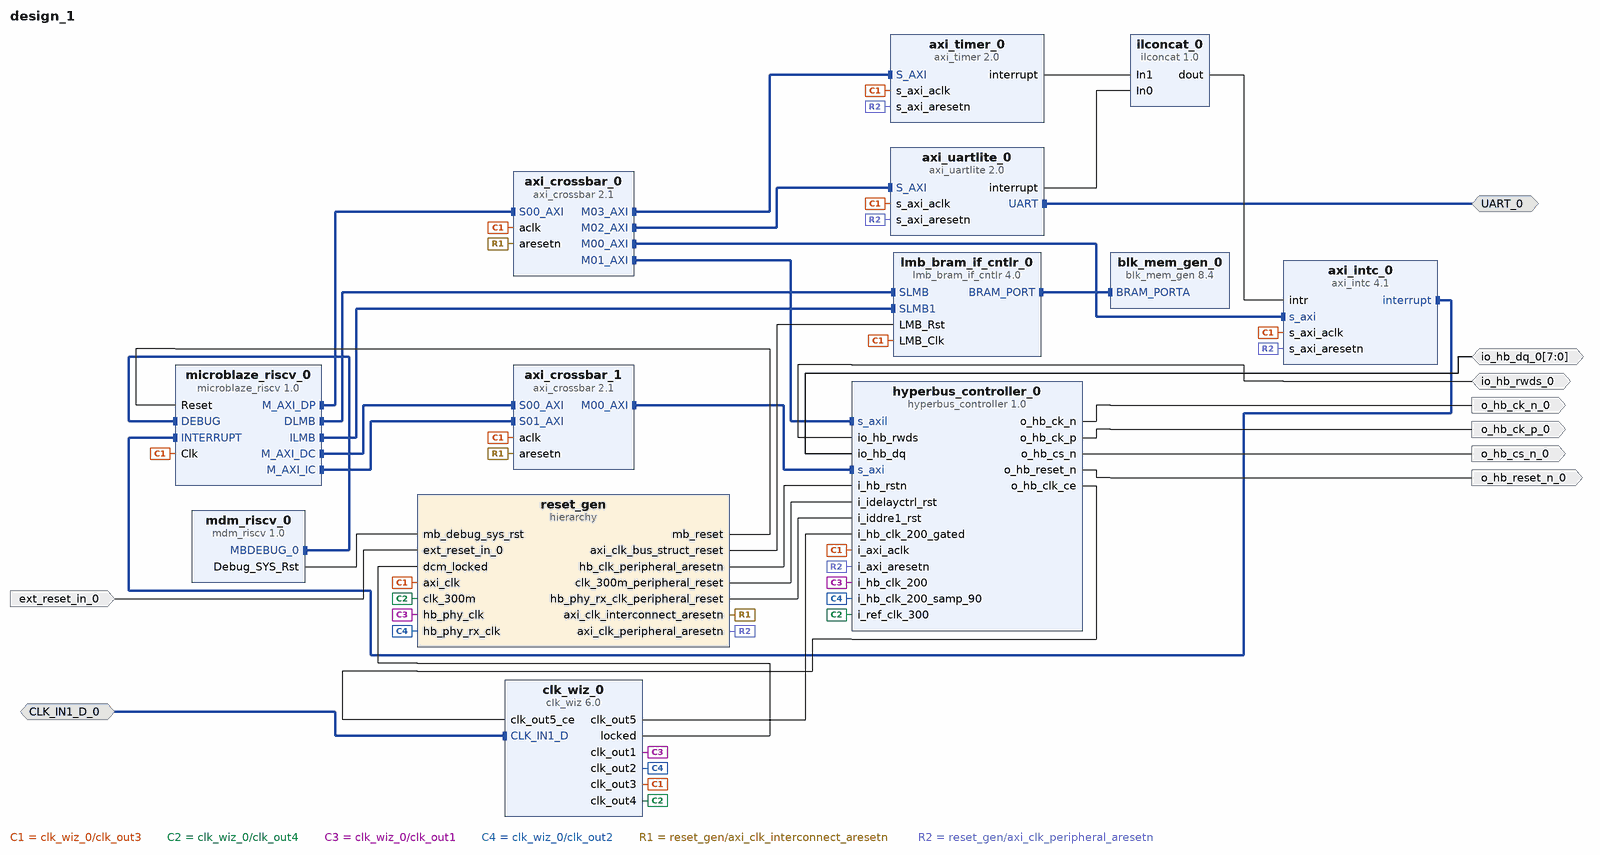
[diagram p0: block diagram of the top level]
# Vivado block design design_1, xcsu35p-sbvb625-2-e, Vivado 2025.2
create_bd_design design_1

create_bd_intf_port -mode Slave -vlnv xilinx.com:interface:diff_clock_rtl:1.0 CLK_IN1_D_0
create_bd_intf_port -mode Master -vlnv xilinx.com:interface:uart_rtl:1.0 UART_0
create_bd_port -dir O o_hb_cs_n_0
create_bd_port -dir O o_hb_ck_p_0
create_bd_port -dir O o_hb_ck_n_0
create_bd_port -dir IO io_hb_rwds_0
create_bd_port -dir IO -from 7 -to 0 io_hb_dq_0
create_bd_port -dir O o_hb_reset_n_0
create_bd_port -dir I -type rst ext_reset_in_0

create_bd_cell -type ip -vlnv xilinx.com:ip:microblaze_riscv:1.0 microblaze_riscv_0
set_property -dict [list \
  CONFIG.C_D_AXI 1 \
  CONFIG.C_I_AXI 0 \
  CONFIG.C_I_LMB 1 \
  CONFIG.C_USE_BITMAN_A 0 \
  CONFIG.C_USE_DCACHE 1 \
  CONFIG.C_USE_ICACHE 1 \
  CONFIG.G_TEMPLATE_LIST 1 \
] [get_bd_cells microblaze_riscv_0]
create_bd_cell -type ip -vlnv xilinx.com:ip:mdm_riscv:1.0 mdm_riscv_0
create_bd_cell -type ip -vlnv xilinx.com:ip:clk_wiz:6.0 clk_wiz_0
set_property -dict [list \
  CONFIG.AXI_DRP false \
  CONFIG.CLKOUT1_JITTER 102.086 \
  CONFIG.CLKOUT1_MATCHED_ROUTING true \
  CONFIG.CLKOUT1_REQUESTED_OUT_FREQ 200 \
  CONFIG.CLKOUT2_JITTER 102.086 \
  CONFIG.CLKOUT2_MATCHED_ROUTING true \
  CONFIG.CLKOUT2_PHASE_ERROR 87.180 \
  CONFIG.CLKOUT2_REQUESTED_OUT_FREQ 200 \
  CONFIG.CLKOUT2_REQUESTED_PHASE 90 \
  CONFIG.CLKOUT2_USED true \
  CONFIG.CLKOUT3_JITTER 132.683 \
  CONFIG.CLKOUT3_PHASE_ERROR 87.180 \
  CONFIG.CLKOUT3_REQUESTED_OUT_FREQ 50 \
  CONFIG.CLKOUT3_REQUESTED_PHASE 0 \
  CONFIG.CLKOUT3_USED true \
  CONFIG.CLKOUT4_JITTER 94.862 \
  CONFIG.CLKOUT4_PHASE_ERROR 87.180 \
  CONFIG.CLKOUT4_REQUESTED_OUT_FREQ 300 \
  CONFIG.CLKOUT4_USED true \
  CONFIG.CLKOUT5_DRIVES Buffer_with_CE \
  CONFIG.CLKOUT5_JITTER 102.086 \
  CONFIG.CLKOUT5_MATCHED_ROUTING true \
  CONFIG.CLKOUT5_PHASE_ERROR 87.180 \
  CONFIG.CLKOUT5_REQUESTED_OUT_FREQ 200 \
  CONFIG.CLKOUT5_USED true \
  CONFIG.CLK_IN1_BOARD_INTERFACE sys_diff_clock \
  CONFIG.MMCM_CLKOUT0_DIVIDE_F 6.000 \
  CONFIG.MMCM_CLKOUT1_DIVIDE 6 \
  CONFIG.MMCM_CLKOUT1_PHASE 90.000 \
  CONFIG.MMCM_CLKOUT2_DIVIDE 24 \
  CONFIG.MMCM_CLKOUT2_PHASE 0.000 \
  CONFIG.MMCM_CLKOUT3_DIVIDE 4 \
  CONFIG.MMCM_CLKOUT4_DIVIDE 6 \
  CONFIG.NUM_OUT_CLKS 5 \
  CONFIG.OPTIMIZE_CLOCKING_STRUCTURE_EN false \
  CONFIG.PHASE_DUTY_CONFIG false \
  CONFIG.PRIM_SOURCE Differential_clock_capable_pin \
  CONFIG.USE_DYN_PHASE_SHIFT false \
  CONFIG.USE_DYN_RECONFIG false \
] [get_bd_cells clk_wiz_0]
create_bd_cell -type ip -vlnv xilinx.com:ip:axi_crossbar:2.1 axi_crossbar_0
set_property -dict {CONFIG.NUM_MI 4 CONFIG.NUM_SI 1} [get_bd_cells axi_crossbar_0]
create_bd_cell -type ip -vlnv xilinx.com:ip:blk_mem_gen:8.4 blk_mem_gen_0
create_bd_cell -type ip -vlnv xilinx.com:ip:lmb_bram_if_cntlr:4.0 lmb_bram_if_cntlr_0
set_property -dict {CONFIG.C_NUM_LMB 2} [get_bd_cells lmb_bram_if_cntlr_0]
create_bd_cell -type ip -vlnv xilinx.com:ip:axi_uartlite:2.0 axi_uartlite_0
set_property -dict {CONFIG.C_BAUDRATE 115200} [get_bd_cells axi_uartlite_0]
create_bd_cell -type ip -vlnv xilinx.com:ip:axi_intc:4.1 axi_intc_0
create_bd_cell -type ip -vlnv xilinx.com:ip:axi_crossbar:2.1 axi_crossbar_1
set_property -dict {CONFIG.NUM_MI 1 CONFIG.NUM_SI 2} [get_bd_cells axi_crossbar_1]
create_bd_cell -type ip -vlnv xilinx.com:ip:axi_timer:2.0 axi_timer_0
create_bd_cell -type inline_hdl -vlnv xilinx.com:inline_hdl:ilconcat:1.0 ilconcat_0
create_bd_cell -type ip -vlnv user.org:user:hyperbus_controller:1.0 hyperbus_controller_0
create_bd_cell -type hier reset_gen

# ---- hierarchy /reset_gen ----
current_bd_instance /reset_gen
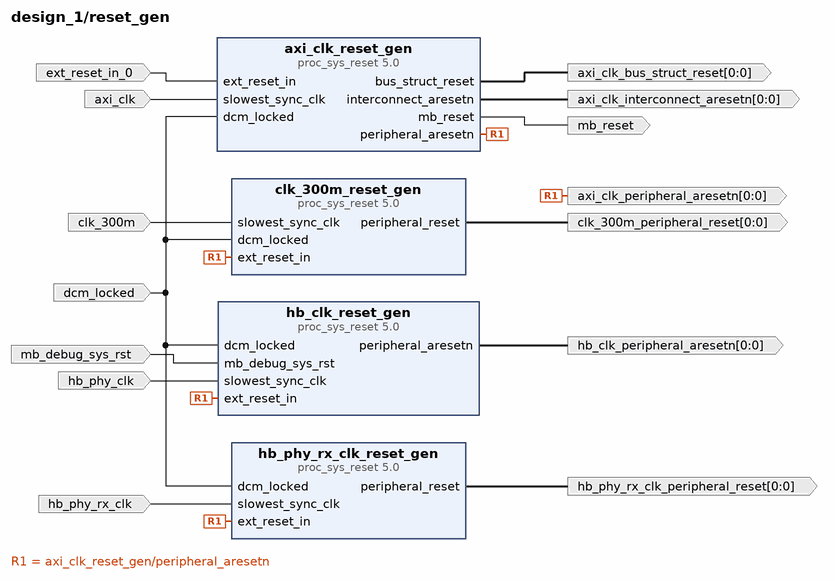
[diagram p1: block diagram inside /reset_gen]
create_bd_pin -dir I dcm_locked
create_bd_pin -dir I -type rst mb_debug_sys_rst
create_bd_pin -dir I -type clk hb_phy_clk
create_bd_pin -dir O -from 0 -to 0 -type rst hb_clk_peripheral_aresetn
create_bd_pin -dir O -from 0 -to 0 -type rst axi_clk_interconnect_aresetn
create_bd_pin -dir O -from 0 -to 0 -type rst axi_clk_peripheral_aresetn
create_bd_pin -dir O -from 0 -to 0 -type rst axi_clk_bus_struct_reset
create_bd_pin -dir I -type clk axi_clk
create_bd_pin -dir O -type rst mb_reset
create_bd_pin -dir I -type rst ext_reset_in_0
create_bd_pin -dir I -type clk clk_300m
create_bd_pin -dir O -from 0 -to 0 -type rst clk_300m_peripheral_reset
create_bd_pin -dir I -type clk hb_phy_rx_clk
create_bd_pin -dir O -from 0 -to 0 -type rst hb_phy_rx_clk_peripheral_reset

create_bd_cell -type ip -vlnv xilinx.com:ip:proc_sys_reset:5.0 hb_clk_reset_gen
create_bd_cell -type ip -vlnv xilinx.com:ip:proc_sys_reset:5.0 axi_clk_reset_gen
create_bd_cell -type ip -vlnv xilinx.com:ip:proc_sys_reset:5.0 clk_300m_reset_gen
create_bd_cell -type ip -vlnv xilinx.com:ip:proc_sys_reset:5.0 hb_phy_rx_clk_reset_gen

# ---- connections ----

current_bd_instance /reset_gen
connect_bd_net [get_bd_pins dcm_locked] \
  [get_bd_pins hb_clk_reset_gen/dcm_locked] [get_bd_pins axi_clk_reset_gen/dcm_locked] \
  [get_bd_pins clk_300m_reset_gen/dcm_locked] [get_bd_pins hb_phy_rx_clk_reset_gen/dcm_locked]
connect_bd_net -net ext_reset_in_0_1 [get_bd_pins ext_reset_in_0] [get_bd_pins axi_clk_reset_gen/ext_reset_in]
connect_bd_net [get_bd_pins mb_debug_sys_rst] [get_bd_pins hb_clk_reset_gen/mb_debug_sys_rst]
connect_bd_net -net proc_sys_reset_0_peripheral_aresetn [get_bd_pins hb_clk_reset_gen/peripheral_aresetn] [get_bd_pins hb_clk_peripheral_aresetn]
connect_bd_net -net proc_sys_reset_1_bus_struct_reset [get_bd_pins axi_clk_reset_gen/bus_struct_reset] [get_bd_pins axi_clk_bus_struct_reset]
connect_bd_net -net proc_sys_reset_1_interconnect_aresetn [get_bd_pins axi_clk_reset_gen/interconnect_aresetn] \
  [get_bd_pins axi_clk_interconnect_aresetn]
connect_bd_net -net proc_sys_reset_1_mb_reset [get_bd_pins axi_clk_reset_gen/mb_reset] [get_bd_pins mb_reset]
connect_bd_net -net proc_sys_reset_1_peripheral_aresetn [get_bd_pins axi_clk_reset_gen/peripheral_aresetn] \
  [get_bd_pins hb_clk_reset_gen/ext_reset_in] [get_bd_pins axi_clk_peripheral_aresetn] \
  [get_bd_pins clk_300m_reset_gen/ext_reset_in] [get_bd_pins hb_phy_rx_clk_reset_gen/ext_reset_in]
connect_bd_net -net proc_sys_reset_2_peripheral_reset [get_bd_pins clk_300m_reset_gen/peripheral_reset] [get_bd_pins clk_300m_peripheral_reset]
connect_bd_net -net proc_sys_reset_3_peripheral_reset [get_bd_pins hb_phy_rx_clk_reset_gen/peripheral_reset] \
  [get_bd_pins hb_phy_rx_clk_peripheral_reset]
connect_bd_net -net slowest_sync_clk1_1 [get_bd_pins axi_clk] [get_bd_pins axi_clk_reset_gen/slowest_sync_clk]
connect_bd_net -net slowest_sync_clk2_1 [get_bd_pins clk_300m] [get_bd_pins clk_300m_reset_gen/slowest_sync_clk]
connect_bd_net -net slowest_sync_clk3_1 [get_bd_pins hb_phy_rx_clk] [get_bd_pins hb_phy_rx_clk_reset_gen/slowest_sync_clk]
connect_bd_net -net slowest_sync_clk_1 [get_bd_pins hb_phy_clk] [get_bd_pins hb_clk_reset_gen/slowest_sync_clk]

current_bd_instance /
connect_bd_intf_net -intf_net CLK_IN1_D_0_1 [get_bd_intf_ports CLK_IN1_D_0] [get_bd_intf_pins clk_wiz_0/CLK_IN1_D]
connect_bd_intf_net [get_bd_intf_pins axi_crossbar_0/M00_AXI] [get_bd_intf_pins axi_intc_0/s_axi]
connect_bd_intf_net [get_bd_intf_pins axi_crossbar_0/M01_AXI] [get_bd_intf_pins hyperbus_controller_0/s_axil]
connect_bd_intf_net [get_bd_intf_pins axi_crossbar_0/M02_AXI] [get_bd_intf_pins axi_uartlite_0/S_AXI]
connect_bd_intf_net [get_bd_intf_pins axi_crossbar_0/M03_AXI] [get_bd_intf_pins axi_timer_0/S_AXI]
connect_bd_intf_net [get_bd_intf_pins axi_crossbar_1/M00_AXI] [get_bd_intf_pins hyperbus_controller_0/s_axi]
connect_bd_intf_net [get_bd_intf_pins axi_intc_0/interrupt] [get_bd_intf_pins microblaze_riscv_0/INTERRUPT]
connect_bd_intf_net [get_bd_intf_ports UART_0] [get_bd_intf_pins axi_uartlite_0/UART]
connect_bd_intf_net [get_bd_intf_pins lmb_bram_if_cntlr_0/BRAM_PORT] [get_bd_intf_pins blk_mem_gen_0/BRAM_PORTA]
connect_bd_intf_net [get_bd_intf_pins mdm_riscv_0/MBDEBUG_0] [get_bd_intf_pins microblaze_riscv_0/DEBUG]
connect_bd_intf_net [get_bd_intf_pins microblaze_riscv_0/DLMB] [get_bd_intf_pins lmb_bram_if_cntlr_0/SLMB]
connect_bd_intf_net [get_bd_intf_pins lmb_bram_if_cntlr_0/SLMB1] [get_bd_intf_pins microblaze_riscv_0/ILMB]
connect_bd_intf_net [get_bd_intf_pins microblaze_riscv_0/M_AXI_DC] [get_bd_intf_pins axi_crossbar_1/S00_AXI]
connect_bd_intf_net [get_bd_intf_pins microblaze_riscv_0/M_AXI_DP] [get_bd_intf_pins axi_crossbar_0/S00_AXI]
connect_bd_intf_net [get_bd_intf_pins microblaze_riscv_0/M_AXI_IC] [get_bd_intf_pins axi_crossbar_1/S01_AXI]
connect_bd_net [get_bd_ports io_hb_rwds_0] [get_bd_pins hyperbus_controller_0/io_hb_rwds]
connect_bd_net [get_bd_ports io_hb_dq_0] [get_bd_pins hyperbus_controller_0/io_hb_dq]
connect_bd_net -net axi_clk [get_bd_pins clk_wiz_0/clk_out3] \
  [get_bd_pins microblaze_riscv_0/Clk] [get_bd_pins axi_crossbar_1/aclk] [get_bd_pins axi_crossbar_0/aclk] \
  [get_bd_pins lmb_bram_if_cntlr_0/LMB_Clk] [get_bd_pins axi_uartlite_0/s_axi_aclk] [get_bd_pins axi_intc_0/s_axi_aclk] \
  [get_bd_pins axi_timer_0/s_axi_aclk] [get_bd_pins reset_gen/axi_clk] [get_bd_pins hyperbus_controller_0/i_axi_aclk]
connect_bd_net [get_bd_pins axi_timer_0/interrupt] [get_bd_pins ilconcat_0/In1]
connect_bd_net [get_bd_pins axi_uartlite_0/interrupt] [get_bd_pins ilconcat_0/In0]
connect_bd_net -net clk_300m [get_bd_pins clk_wiz_0/clk_out4] [get_bd_pins reset_gen/clk_300m] [get_bd_pins hyperbus_controller_0/i_ref_clk_300]
connect_bd_net [get_bd_pins clk_wiz_0/locked] [get_bd_pins reset_gen/dcm_locked]
connect_bd_net -net ext_reset_in_0_1 [get_bd_ports ext_reset_in_0] [get_bd_pins reset_gen/ext_reset_in_0]
connect_bd_net -net hb_clk_gated [get_bd_pins clk_wiz_0/clk_out5] [get_bd_pins hyperbus_controller_0/i_hb_clk_200_gated]
connect_bd_net -net hb_phy_clk [get_bd_pins clk_wiz_0/clk_out1] [get_bd_pins reset_gen/hb_phy_clk] [get_bd_pins hyperbus_controller_0/i_hb_clk_200]
connect_bd_net -net hb_phy_rx_clk [get_bd_pins clk_wiz_0/clk_out2] \
  [get_bd_pins reset_gen/hb_phy_rx_clk] [get_bd_pins hyperbus_controller_0/i_hb_clk_200_samp_90]
connect_bd_net -net hyperbus_controller_1_o_hb_ck_n [get_bd_pins hyperbus_controller_0/o_hb_ck_n] [get_bd_ports o_hb_ck_n_0]
connect_bd_net -net hyperbus_controller_1_o_hb_ck_p [get_bd_pins hyperbus_controller_0/o_hb_ck_p] [get_bd_ports o_hb_ck_p_0]
connect_bd_net -net hyperbus_controller_1_o_hb_clk_ce [get_bd_pins hyperbus_controller_0/o_hb_clk_ce] [get_bd_pins clk_wiz_0/clk_out5_ce]
connect_bd_net -net hyperbus_controller_1_o_hb_cs_n [get_bd_pins hyperbus_controller_0/o_hb_cs_n] [get_bd_ports o_hb_cs_n_0]
connect_bd_net -net hyperbus_controller_1_o_hb_reset_n [get_bd_pins hyperbus_controller_0/o_hb_reset_n] [get_bd_ports o_hb_reset_n_0]
connect_bd_net [get_bd_pins ilconcat_0/dout] [get_bd_pins axi_intc_0/intr]
connect_bd_net [get_bd_pins mdm_riscv_0/Debug_SYS_Rst] [get_bd_pins reset_gen/mb_debug_sys_rst]
connect_bd_net -net proc_sys_reset_1_interconnect_aresetn [get_bd_pins reset_gen/axi_clk_interconnect_aresetn] \
  [get_bd_pins axi_crossbar_0/aresetn] [get_bd_pins axi_crossbar_1/aresetn]
connect_bd_net -net proc_sys_reset_1_peripheral_aresetn [get_bd_pins reset_gen/axi_clk_peripheral_aresetn] \
  [get_bd_pins axi_uartlite_0/s_axi_aresetn] [get_bd_pins axi_intc_0/s_axi_aresetn] [get_bd_pins axi_timer_0/s_axi_aresetn] \
  [get_bd_pins hyperbus_controller_0/i_axi_aresetn]
connect_bd_net -net reset_gen_bus_struct_reset [get_bd_pins reset_gen/axi_clk_bus_struct_reset] [get_bd_pins lmb_bram_if_cntlr_0/LMB_Rst]
connect_bd_net [get_bd_pins reset_gen/mb_reset] [get_bd_pins microblaze_riscv_0/Reset]
connect_bd_net -net reset_gen_peripheral_aresetn [get_bd_pins reset_gen/hb_clk_peripheral_aresetn] [get_bd_pins hyperbus_controller_0/i_hb_rstn]
connect_bd_net -net reset_gen_peripheral_reset [get_bd_pins reset_gen/clk_300m_peripheral_reset] [get_bd_pins hyperbus_controller_0/i_idelayctrl_rst]
connect_bd_net -net reset_gen_peripheral_reset1 [get_bd_pins reset_gen/hb_phy_rx_clk_peripheral_reset] \
  [get_bd_pins hyperbus_controller_0/i_iddre1_rst]
set_property HDL_ATTRIBUTE.BMM_INFO_PROCESSOR {riscv > design_1 lmb_bram_if_cntlr_0} [get_bd_cells microblaze_riscv_0]
set_property HDL_ATTRIBUTE.KEEP_HIERARCHY yes [get_bd_cells microblaze_riscv_0]
set_property HDL_ATTRIBUTE.BMM_INFO_ADDRESS_SPACE {byte  0x00000000 32 > design_1 blk_mem_gen_0} [get_bd_cells lmb_bram_if_cntlr_0]
set_property HDL_ATTRIBUTE.KEEP_HIERARCHY yes [get_bd_cells lmb_bram_if_cntlr_0]

# ---- address map ----
assign_bd_address -offset 0x00000000 -range 32K -target_address_space [get_bd_addr_spaces microblaze_riscv_0/Data] [get_bd_addr_segs lmb_bram_if_cntlr_0/SLMB/Mem]
assign_bd_address -offset 0x00010000 -range 64K -target_address_space [get_bd_addr_spaces microblaze_riscv_0/Data] [get_bd_addr_segs hyperbus_controller_0/s_axil/reg0]
assign_bd_address -offset 0x40600000 -range 64K -target_address_space [get_bd_addr_spaces microblaze_riscv_0/Data] [get_bd_addr_segs axi_uartlite_0/S_AXI/Reg]
assign_bd_address -offset 0x41200000 -range 64K -target_address_space [get_bd_addr_spaces microblaze_riscv_0/Data] [get_bd_addr_segs axi_intc_0/S_AXI/Reg]
assign_bd_address -offset 0x41C00000 -range 64K -target_address_space [get_bd_addr_spaces microblaze_riscv_0/Data] [get_bd_addr_segs axi_timer_0/S_AXI/Reg]
assign_bd_address -offset 0x80000000 -range 8M -target_address_space [get_bd_addr_spaces microblaze_riscv_0/Data] [get_bd_addr_segs hyperbus_controller_0/s_axi/reg0]
assign_bd_address -offset 0x00000000 -range 32K -target_address_space [get_bd_addr_spaces microblaze_riscv_0/Instruction] [get_bd_addr_segs lmb_bram_if_cntlr_0/SLMB1/Mem]
assign_bd_address -offset 0x80000000 -range 8M -target_address_space [get_bd_addr_spaces microblaze_riscv_0/Instruction] [get_bd_addr_segs hyperbus_controller_0/s_axi/reg0]

validate_bd_design
save_bd_design
